# EAGLE design id12-breakout (EAGLE 5.12)
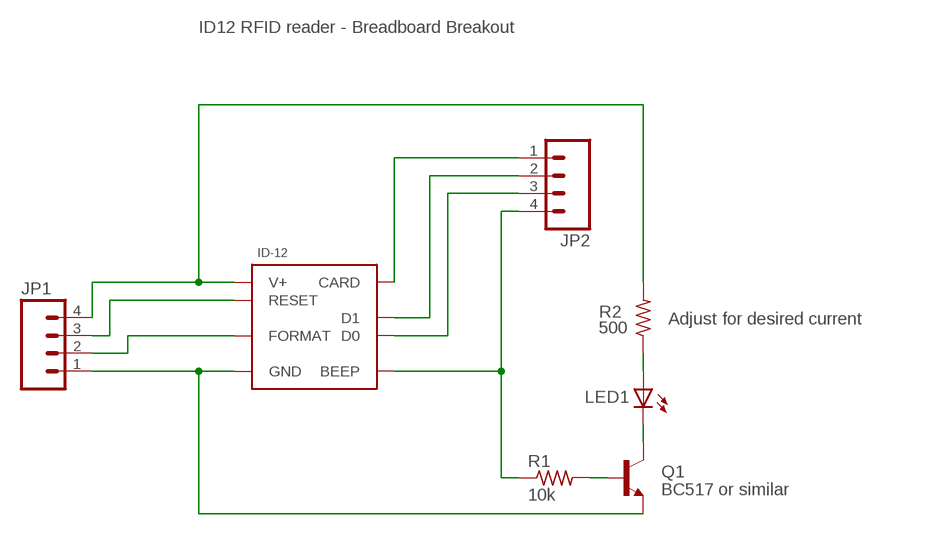
[diagram p0: schematic, sheet 1]

## Parts
ID-12  ID-12SOCKET  [ID-12-SOCKET]
JP1  M04LOCK  [1X04_LOCK]
JP2  M04LOCK  [1X04_LOCK]
LED1  LEDCHIP-LED0805  [CHIP-LED0805]
Q1  BC517 or similar  TRANSISTOR_NPNSOT23  [SOT23]
R1  10k  R-US_M0805  [M0805]
R2  500  R-US_M0805  [M0805]

## Nets
BEEP: ID-12.P$10(BEEP) JP2.4 R1.1
CARD: ID-12.P$5(CARD) JP2.1
D1: ID-12.P$8(D1) JP2.2
DO: ID-12.P$9(D0) JP2.3
FORMAT: ID-12.P$7(FORMAT) JP1.2
GND: ID-12.P$1(GND) JP1.1 Q1.2(E)
N$2: Q1.1(B) R1.2
N$3: LED1.C Q1.3(C)
N$4: LED1.A R2.1
RESET: ID-12.P$2(RESET) JP1.3
V+: ID-12.P$12(V+) JP1.4 R2.2

## Notes on the sheet
- ID12 RFID reader - Breadboard Breakout
- Adjust for desired current

## Library data of the parts
ID-12 = karlnet-parts:ID-12: ID-12 125khz RFID reader, builtin antenna ID Innovations part, available from sparkfun: https://www.sparkfun.com/products/8419
JP1 JP2 = SparkFun:M04: Header 4 Standard 4-pin 0.1" header. Use with straight break away headers (SKU : PRT-00116), right angle break away headers (PRT-00553), swiss pins (PRT-00743), machine pins (PRT-00117), and female headers (PRT-00115). Molex polarized connector foot print use with SKU : PRT-08231 with associated crimp pins and housings. 1MM SMD Version SKU: PRT-10208
LED1 = adafruit:LED: LED OSRAM: - CHIPLED LG R971, LG N971, LY N971, LG Q971, LY Q971, LO R971, LY R971 LH N974, LH R974 LS Q976, LO Q976, LY Q976 LO Q996 - Hyper CHIPLED LW Q18S LB Q993, LB Q99A, LB R99A - SideLED LS A670, LO A670, LY A670, LG A670, LP A670 LB A673, LV A673, LT A673, LW A673 LH A674 LY A675 LS A676, LA A676, LO A676, LY A676, LW A676 LS A679, LY A679, LG A679 - Hyper Micro SIDELED® LS Y876, LA Y876, LO Y876, LY Y876 LT Y87S - SmartLED LW L88C, LW L88S LB L89C, LB L89S, LG L890 LS L89K, LO L89K, LY L89K LS L896, LA L896, LO L896, LY L896 - TOPLED LS T670, LO T670, LY T670, LG T670, LP T670 LSG T670, LSP T670, LSY T670, LOP T670, LYG T670 LG T671, LOG T671, LSG T671 LB T673, LV T673, LT T673, LW T673 LH T674 LS T676, LA T676, LO T676, LY T676, LB T676, LH T676, LSB T676, LW T676 LB T67C, LV T67C, LT T67C, LS T67K, LO T67K, LY T67K, LW E67C LS E67B, LA E67B, LO E67B, LY E67B, LB E67C, LV E67C, LT E67C LW T67C LS T679, LY T679, LG T679 LS T770, LO T770, LY T770, LG T770, LP T770 LB T773, LV T773, LT T773, LW T773 LH T774 LS E675, LA E675, LY E675, LS T675 LS T776, LA T776, LO T776, LY T776, LB T776 LHGB T686 LT T68C, LB T68C - Hyper Mini TOPLED® LB M676 - Mini TOPLED Santana® LG M470 LS M47K, LO M47K, LY M47K Source: http://www.osram.convergy.de/
Q1 = SparkFun:TRANSISTOR_NPN: Transistor NPN BJT configuration in SOT23 package. MMBT2222 is the common NPN we use. Double check BCE configuration again layout.
R1 R2 = rcl:R-US_: RESISTOR, American symbol

## Board
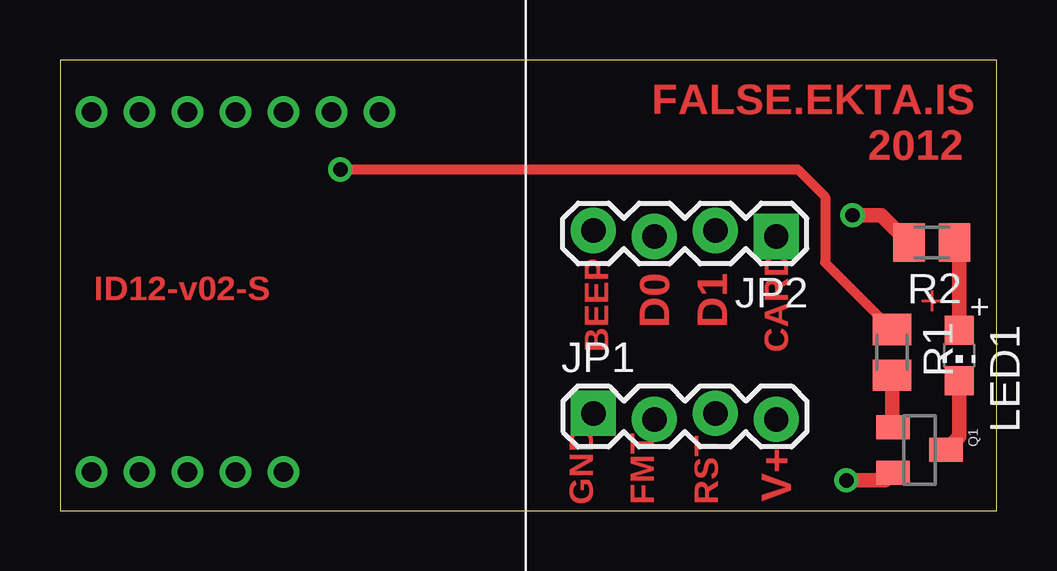
[diagram p1: board, top side]
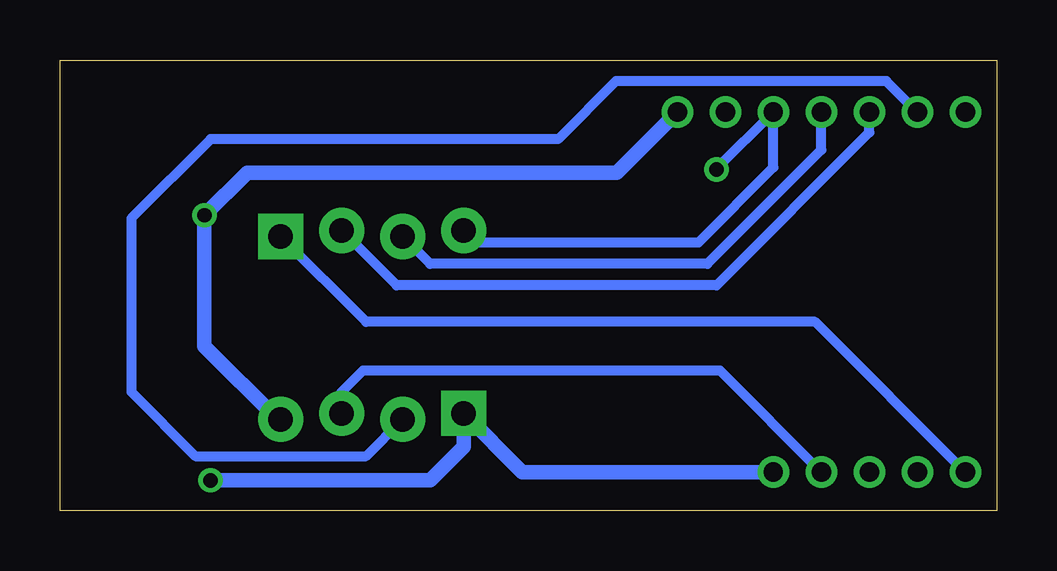
[diagram p2: board, bottom side, seen from below]

Size 39.04 x 18.79 mm. Coordinates in mm from the lower left corner, seen from the top.
Outline: 0,0 39.04,0 39.04,18.79 0,18.79 0,0
Copper layers (1*16): Top 0.035mm / dielectric 1.5mm / Bottom 0.035mm
Design rules "lpkf-karls-basic": minimum track width 0.1mm, minimum drill 0.6mm, track to track 8mil, track to pad 8mil, pad to pad 8mil, via to via 8mil, smd to smd 8mil, copper to edge 20mil, drill to drill 8mil, minimum pad ring 10mil, minimum via ring 8mil, stop-mask expansion 4mil, vias tented up to drill 0mil, thermal gap 10mil

### Footprints (pad centres in the part's own frame; a part is rotated, then mirrored left to right if it is on the bottom)
ID-12-SOCKET = drill 0.8 round: P$1 16.3,5.3; P$2 14.3,5.3; P$3 12.3,5.3; P$4 10.3,5.3; P$5 8.3,5.3; P$6 8.3,20.3; P$7 10.3,20.3; P$8 12.3,20.3; P$9 14.3,20.3; P$10 16.3,20.3; P$11 18.3,20.3; P$12 20.3,20.3
1X04_LOCK = drill 1.016 pad 1.88 square: 1 0,0.127 | drill 1.016 pad 1.88 round: 2 2.54,-0.127; 3 5.08,0.127; 4 7.62,-0.127
CHIP-LED0805 = smd 1.2 x 1.2: A 0,-1.05; C 0,1.05
SOT23 = smd 1 x 1.4: 1 -0.95,-1.1; 2 0.95,-1.1; 3 0,1.1
M0805 = smd 1.3 x 1.6: 1 -0.95,0; 2 0.95,0

### Placement (x,y rotation side)
ID-12  -6.99,-3.68 0 top
JP1  22.23,3.94 0 top
JP2  29.84,11.56 180 top
LED1  37.47,6.48 180 top
Q1  35.81,2.54 270 top
R1  34.67,6.6 270 top
R2  36.32,11.18 180 top

### Tracks (layer width: path | path; a pad name or v marks a point on that pad's centre or on a via)
BEEP  (via drill 0.6)
  Top 0.406: v11.68,14.22 30.73,14.22 31.88,13.08 31.88,10.35 R1.1
  Top 0.61: R1.1 34.6,7.62
  Bottom 0.254: 11.71,14.22 v11.68,14.22
  Bottom 0.406: 11.71,14.22 ID-12.P$10 9.31,14.31 12.45,11.18 21.72,11.18 JP2.4
CARD
  Bottom 0.406: ID-12.P$5 7.57,7.87 26.29,7.87 JP2.1
D1
  Bottom 0.406: ID-12.P$8 5.32,15.77 11.68,9.4 25.02,9.4 JP2.2
DO
  Bottom 0.406: ID-12.P$9 7.32,15.04 12.06,10.29 23.62,10.29 JP2.3
FORMAT
  Bottom 0.406: JP1.2 26.29,2.29 33.4,2.29 36.07,4.95 36.07,12.19 32.77,15.49 18.29,15.49 15.88,17.91 4.61,17.91 ID-12.P$7
GND  (via drill 0.6)
  Top 0.61: Q1.2 34.39,1.27 v32.77,1.27
  Bottom 0.61: ID-12.P$1 19.78,1.62 JP1.1 22.23,2.67 23.62,1.27 v32.77,1.27
N$2
  Top 0.61: Q1.1 34.67,3.53 R1.2
N$3
  Top 0.61: Q1.3 37.47,3.09 LED1.C
N$4
  Top 0.61: LED1.A 37.47,11.18 R2.1
RESET
  Bottom 0.406: ID-12.P$2 11.54,5.84 26.42,5.84 27.3,4.95 JP1.3
V+  (via drill 0.6)
  Top 0.61: R2.2 34.23,12.32 v33.02,12.32
  Bottom 0.61: JP1.4 29.97,3.81 33.02,6.86 v33.02,12.32 31.24,14.1 15.84,14.1 ID-12.P$12

### Text on the board
Top: FALSE.EKTA.IS | 2012 | ID12-v02-S | D0 | D1 | + | BEEP | CARD | GND | FMT | RST | V+